# EAGLE design rev_A (EAGLE 8.7.1)
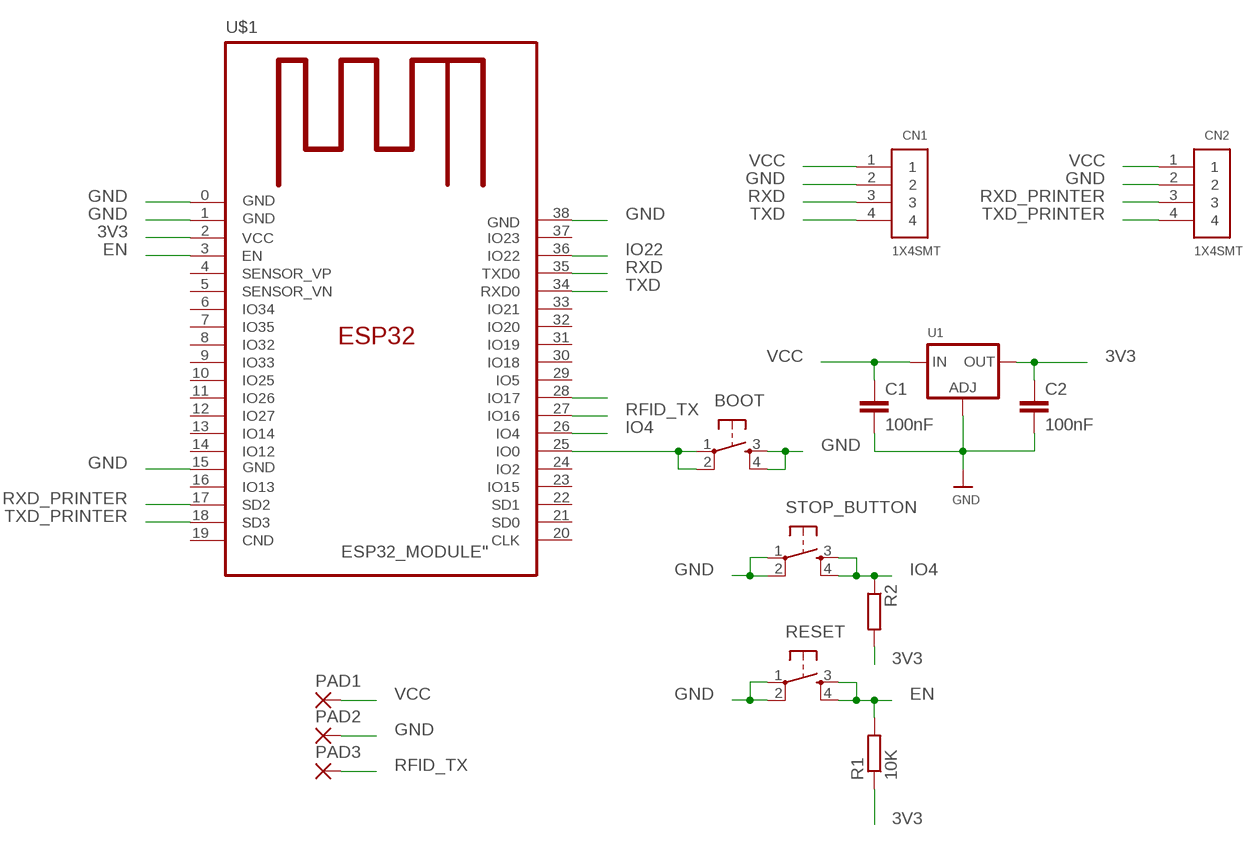
[diagram p0: schematic, sheet 1]

## Parts
BOOT  TACTILE_SWITCHE_5X5_MICRO"  [TACTILE_SWITCH_5X5_MICRO]
C1  100nF  C-EUC0805  [C0805]
C2  100nF  C-EUC0805  [C0805]
CN1  1X4SMT  [1X4-SMT]
CN2  1X4SMT  [1X4-SMT]
PAD1  SMD2  [SMD1,27-2,54]
PAD2  SMD2  [SMD1,27-2,54]
PAD3  SMD2  [SMD1,27-2,54]
R1  10K  R-EU_R0805  [R0805]
R2  10K  R-EU_R0805  [R0805]
RESET  TACTILE_SWITCHE_5X5_MICRO"  [TACTILE_SWITCH_5X5_MICRO]
STOP_BUTTON  TACTILE_SWITCH_THT_  [TACTILE_SWICTH_THT]
U1  LM1117SOT223-REFLOW  [SOT223-R]
U$1  ESP32_MODULE"  [ESP32_MODULE]

## Nets
3V3: C2.1 R1.1 R2.2 U1.2(OUT) U$1.2(VCC)
EN: R1.2 RESET.3 RESET.4 U$1.3(EN)
GND: BOOT.3 BOOT.4 C1.2 C2.2 CN1.2 CN2.2 PAD2.1(P) RESET.1 RESET.2 STOP_BUTTON.1 STOP_BUTTON.2 U1.1(ADJ) U$1.0(GND) U$1.1(GND) U$1.15(GND) U$1.38(GND)
IO4: R2.1 STOP_BUTTON.3 STOP_BUTTON.4 U$1.26(IO4)
IO22: U$1.36(IO22)
N$1: BOOT.1 BOOT.2 U$1.25(IO0)
N$2: U$1.28(IO17)
RFID_TX: PAD3.1(P) U$1.27(IO16)
RXD: CN1.3 U$1.35(TXD0)
RXD_PRINTER: CN2.3 U$1.17(SD2)
TXD: CN1.4 U$1.34(RXD0)
TXD_PRINTER: CN2.4 U$1.18(SD3)
VCC: C1.1 CN1.1 CN2.1 PAD1.1(P) U1.3(IN)
Unconnected: U$1.4(SENSOR_VP) U$1.5(SENSOR_VN) U$1.6(IO34) U$1.7(IO35) U$1.8(IO32) U$1.9(IO33) U$1.10(IO25) U$1.11(IO26) U$1.12(IO27) U$1.13(IO14) U$1.14(IO12) U$1.16(IO13) U$1.19(CND) U$1.20(CLK) U$1.21(SD0) U$1.22(SD1) U$1.23(IO15) U$1.24(IO2) U$1.29(IO5) U$1.30(IO18) U$1.31(IO19) U$1.32(IO20) U$1.33(IO21) U$1.37(IO23)

## Library data of the parts
BOOT RESET = dronecz:TACTILE_SWITCHE_5X5_MICRO
C1 C2 = rcl:C-EU: CAPACITOR, European symbol; SPICEPREFIX: C
CN1 CN2 = adafruit:1X4: 4-pin connector
PAD1-PAD3 = wirepad:SMD2: SMD PAD
R1 R2 = rcl:R-EU_: RESISTOR, European symbol; SPICEPREFIX: R
STOP_BUTTON = dronecz:TACTILE_SWITCH_THT
U1 = microbuilder:LM1117: LM1117 Voltage Regulator LM1117 Adjustable Voltage regulator [Digikey: LM1117IMP-ADJDKR-ND] LM1117 3.3V Voltage regulator [AP1117E33GDIDKR-ND] LM1117 5.0V Voltage regulator [AP1117E50GDIDKR-ND] SOT223-REFLOW - SOT223 package for solder paste/reflow ovens SOT223-WAVE - SOT223 package for hand-soldering (larger pads) Note: For the fixed-voltage regulators, simply set the ADJ pin to GND.
U$1 = dronecz:ESP32_MODULE

## Board
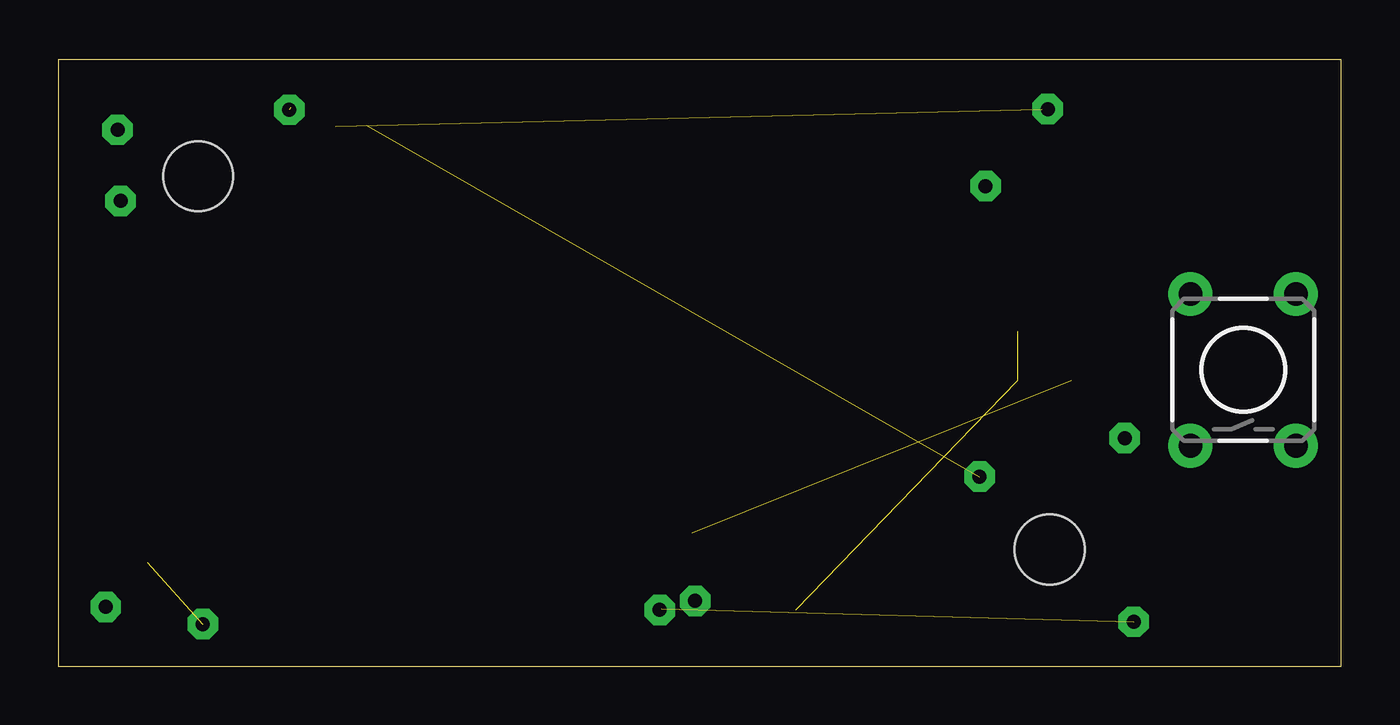
[diagram p1: board, top side]
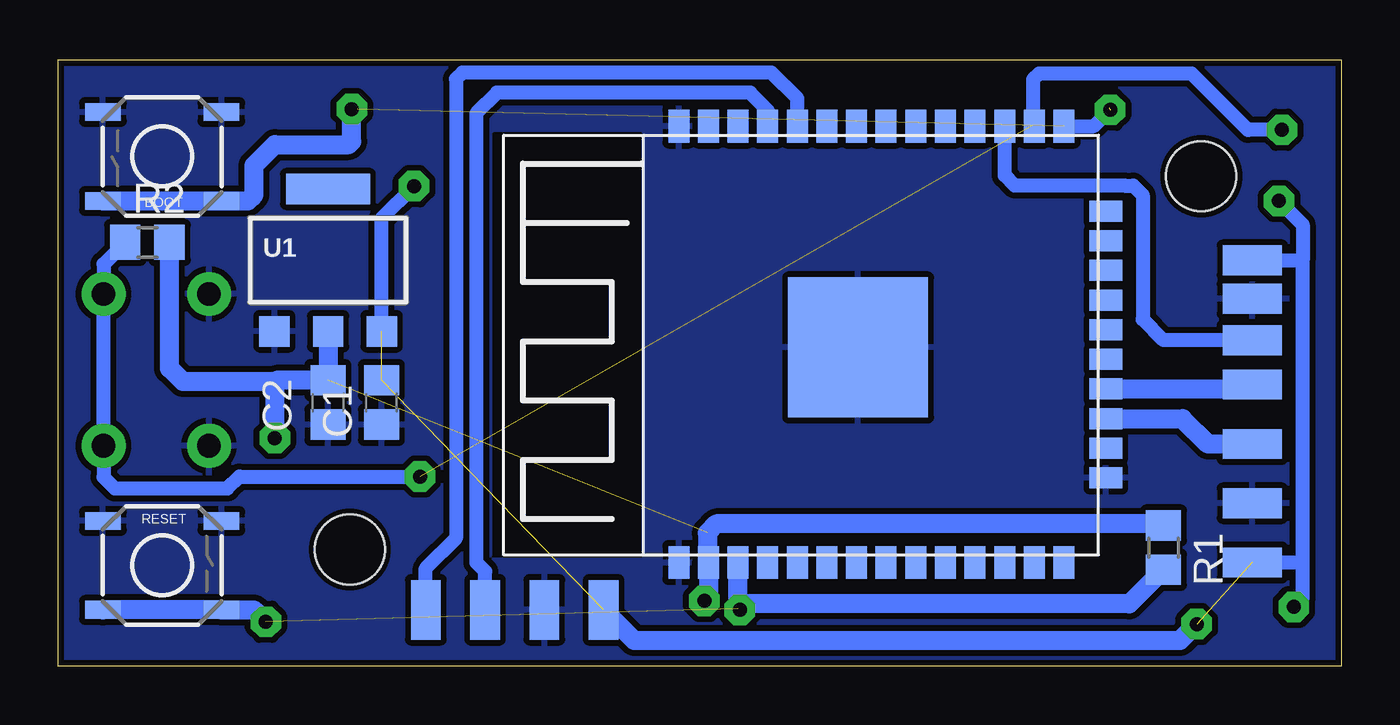
[diagram p2: board, bottom side, seen from below]

Size 55 x 26 mm. Coordinates in mm from the lower left corner, seen from the top.
Outline: 0,0 55,0 55,26 0,26 0,0
Copper layers (1*16): Top 0.035mm / dielectric 1.5mm / Bottom 0.035mm
Design rules "default *": minimum track width 6mil, minimum drill 0.35mm, track to track 10mil, track to pad 10mil, pad to pad 6mil, via to via 6mil, smd to smd 6mil, copper to edge 10mil, drill to drill 20mil, minimum pad ring 10mil, minimum via ring 8mil, stop-mask expansion 4mil, vias tented up to drill 0mil, thermal gap 10mil
Holes 3 mm at 6,21 42.5,5

### Footprints (pad centres in the part's own frame; a part is rotated, then mirrored left to right if it is on the bottom)
TACTILE_SWITCH_5X5_MICRO = smd 1.524 x 0.762: 1 -2.54,1.905; 2 2.54,1.905; 3 -2.54,-1.905; 4 2.54,-1.905
C0805 = smd 1.3 x 1.5: 1 -0.95,0; 2 0.95,0
1X4-SMT = smd 1.27 x 2.54: 1 -3.81,0; 2 -1.27,0; 3 1.27,0; 4 3.81,0
SMD1,27-2,54 = smd 1.27 x 2.54: 1 0,0
R0805 = smd 1.3 x 1.5: 1 -0.95,0; 2 0.95,0
TACTILE_SWICTH_THT = drill 1.016 pad 1.88: 1 -3.251,2.261; 2 3.251,2.261; 3 -3.251,-2.261; 4 3.251,-2.261
SOT223-R = smd 1.3 x 1.3: 1 -2.3,-3.05; 2 0,-3.05; 3 2.3,-3.05 | smd 3.6 x 1.3: 4 0,3.05
ESP32_MODULE = smd 6 x 6: 0 0.026,-0.121 | smd 1.4 x 0.9: 1 -9.194,7.569; 2 -9.194,6.298; 3 -9.194,5.029; 4 -9.194,3.759; 5 -9.194,2.489; 6 -9.194,1.218; 7 -9.194,-0.051; 8 -9.194,-1.321; 9 -9.194,-2.591; 10 -9.194,-3.861; 11 -9.194,-5.131; 12 -9.194,-6.402; 13 -9.194,-7.671; 14 -9.194,-8.941; 25 9.507,-8.941; 26 9.507,-7.671; 27 9.507,-6.402; 28 9.507,-5.131; 29 9.507,-3.861; 30 9.507,-2.591; 31 9.507,-1.321; 32 9.507,-0.051; 33 9.507,1.218; 34 9.507,2.489; 35 9.507,3.759; 36 9.507,5.029; 37 9.507,6.298; 38 9.507,7.569 | smd 0.9 x 1.4: 15 -5.564,-10.742; 16 -4.293,-10.742; 17 -3.023,-10.742; 18 -1.754,-10.742; 19 -0.483,-10.742; 20 0.786,-10.742; 21 2.057,-10.742; 22 3.326,-10.742; 23 4.596,-10.742; 24 5.867,-10.742

### Placement (x,y rotation side)
BOOT  50.55,21.84 180 bottom
C1  41.15,11.3 270 bottom
C2  43.43,11.3 270 bottom
CN1  35.43,2.41 180 bottom
CN2  3.81,8.26 90 bottom
PAD1  3.81,17.4 90 bottom
PAD2  3.81,15.75 90 bottom
PAD3  3.81,13.97 90 bottom
R1  7.62,5.08 270 bottom
R2  51.18,18.16 0 bottom
RESET  50.55,4.32 0 bottom
STOP_BUTTON  50.8,12.7 90 top
U1  43.43,17.4 0 bottom
U$1  20.83,13.63 90 bottom

### Tracks (layer width: path | path; a pad name or v marks a point on that pad's centre or on a via)
3V3  (via drill 0.6 pad 1.3)  (1 unrouted)
  Bottom 0.152: 27.3,4.26 27.18,4.39 U$1.2 | R1.1 7.69,6.1
  Bottom 0.813: U1.2 C2.1 45.66,12.25 45.72,12.19 | 27.18,4.39 27.18,5.71 26.8,6.1 7.69,6.1 | 45.72,12.19 v45.72,9.78 | U$1.2 27.13,2.97 v27.3,2.79 | 45.72,12.19 49.66,12.19 50.23,12.77 R2.2
EN  (via drill 0.6 pad 1.3)  (1 unrouted)
  Bottom 0.152: v25.78,2.41 25.86,2.46
  Bottom 0.813: RESET.3 RESET.4 46.61,2.41 v46.1,1.91 | U$1.3 25.86,2.46 25.65,2.67 9.08,2.67 R1.2
GND
  pour Bottom: -1.27,26.67 -1.27,-1.27 55.88,-1.27 55.88,26.67
IO4  (via drill 0.6 pad 1.3)  (1 unrouted)
  Bottom 0.61: R2.1 53.06,17.23 STOP_BUTTON.4 STOP_BUTTON.3 53.06,8.1 52.58,7.62 47.75,7.62 47.24,8.13 v39.5,8.13 | v2.54,22.99 4,22.99 6.41,25.4 12.95,25.4 13.21,25.15 13.21,23.19 U$1.26
N$1  (via drill 0.6 pad 1.3)  (2 unrouted)
  Top 0.152: v42.42,23.88 42.16,23.88 | 9.97,23.93 9.85,23.93
  Bottom 0.152: 11.86,23.11 U$1.25
  Bottom 0.61: U$1.25 10.61,23.14 v9.91,23.85
  Bottom 0.813: BOOT.2 BOOT.1 46.86,19.94 46.61,20.19 46.61,21.46 45.72,22.35 42.55,22.35 42.42,22.48 v42.42,23.88
RFID_TX
  Bottom 0.152: 14.48,23.09 U$1.27
  Bottom 0.61: PAD3.1 7.62,13.97 8.51,14.86 8.51,20.19 8.91,20.6 9.29,20.6 10.16,20.6 13.99,20.6 14.43,21.03 U$1.27
RXD
  Bottom 0.61: CN1.3 36.7,4.06 37.08,4.45 37.08,23.69 36.2,24.58 25.34,24.58 24.59,23.83 U$1.35
RXD_PRINTER
  Bottom 0.152: 10.03,10.67 U$1.17
  Bottom 0.813: CN2.3 5.71,9.53 6.8,10.61 U$1.17
TXD
  Bottom 0.254: 23.24,23.22 U$1.34
  Bottom 0.61: CN1.4 39.24,4.19 37.95,5.49 37.95,25.17 37.68,25.44 24.43,25.44 23.32,24.33 U$1.34
TXD_PRINTER
  Bottom 0.152: 9.9,12.06 U$1.18
  Bottom 0.813: U$1.18 3.87,11.88 CN2.4
VCC  (via drill 0.6 pad 1.3)  (3 unrouted)
  Bottom 0.61: U1.3 41.13,19.19 v39.75,20.57 | v2.03,2.54 1.65,2.92 1.65,4.45 | 1.65,4.45 1.65,17.4 | PAD1.1 1.65,17.4 | CN2.1 1.65,4.45 | v2.67,19.94 1.65,18.92 1.65,17.4
  Bottom 0.813: v6.2,1.81 6.91,1.09 30.3,1.09 CN1.1